# EAGLE schematic untitled (EAGLE 9.3.0)
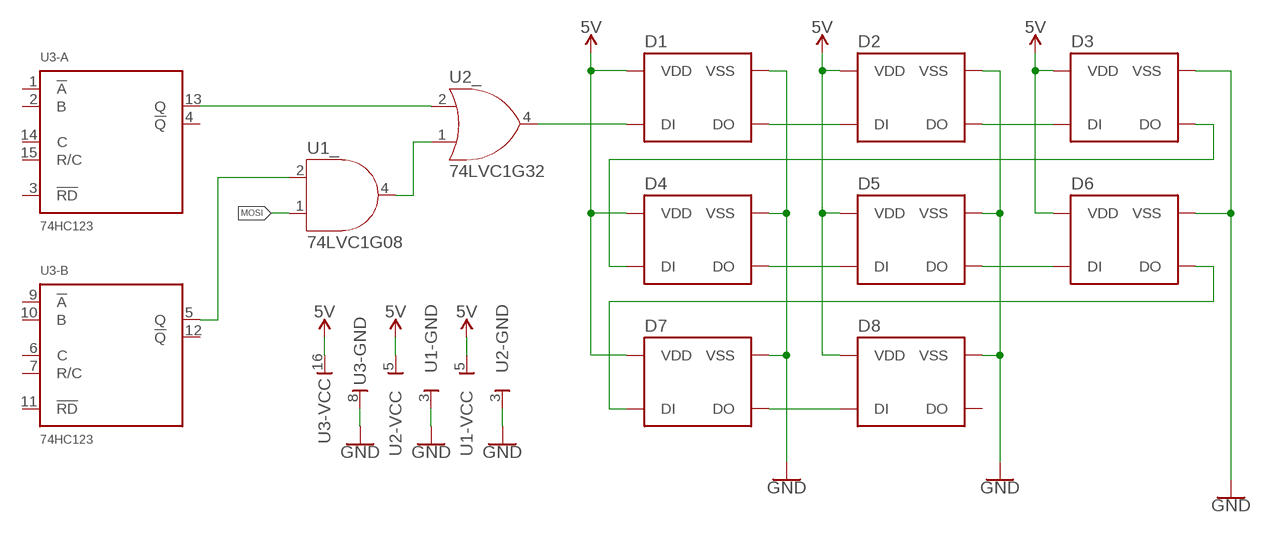
[diagram p0: schematic, sheet 1]

## Parts
D1  WS2812B3535  [3535]
D2  WS2812B3535  [3535]
D3  WS2812B3535  [3535]
D4  WS2812B3535  [3535]
D5  WS2812B3535  [3535]
D6  WS2812B3535  [3535]
D7  WS2812B3535  [3535]
D8  WS2812B3535  [3535]
U1  74LVC1G08  [SC-70-5]
U2  74LVC1G32  [SC-70-5]
U3  74HC123  [TSSOP-16]

## Nets
5V: D1.2(VDD) D2.2(VDD) D3.2(VDD) D4.2(VDD) D5.2(VDD) D6.2(VDD) D7.2(VDD) D8.2(VDD) U1.5 U2.5 U3.16
GND: D1.4(VSS) D2.4(VSS) D3.4(VSS) D4.4(VSS) D5.4(VSS) D6.4(VSS) D7.4(VSS) D8.4(VSS) U1.3 U2.3 U3.8
MOSI: U1.1(_:B)
N$1: U1.4(_:Y) U2.1(_:B)
N$2: U2.2(_:A) U3.13(-A:Q)
N$3: U1.2(_:A) U3.5(-B:Q)
N$4: D7.3(DO) D8.1(DI)
N$6: D1.1(DI) U2.4(_:Y)
N$7: D2.3(DO) D3.1(DI)
N$8: D1.3(DO) D2.1(DI)
N$9: D3.3(DO) D4.1(DI)
N$10: D4.3(DO) D5.1(DI)
N$11: D5.3(DO) D6.1(DI)
N$12: D6.3(DO) D7.1(DI)
Unconnected: D8.3(DO) U3.1(-A:!A) U3.2(-A:B) U3.3(-A:!RD) U3.4(-A:!Q) U3.6(-B:C) U3.7(-B:R/C) U3.9(-B:!A) U3.10(-B:B) U3.11(-B:!RD) U3.12(-B:!Q) U3.14(-A:C) U3.15(-A:R/C)

## Library data of the parts
D1-D8 = Opto-electronics > LED Emitters:WS2812B
U1 = Semiconductors > Integrated Circuits - ICs > Logic ICs > Logic Gates:74LVC1G08
U2 = Semiconductors > Integrated Circuits - ICs > Logic ICs > Logic Gates:74LVC1G32
U3 = Semiconductors > Integrated Circuits - ICs > Logic ICs > Logic Gates:74HC123